# Altium schematic sheet EvoProject 1.0 - Fonte e uC.SchDoc
size A3
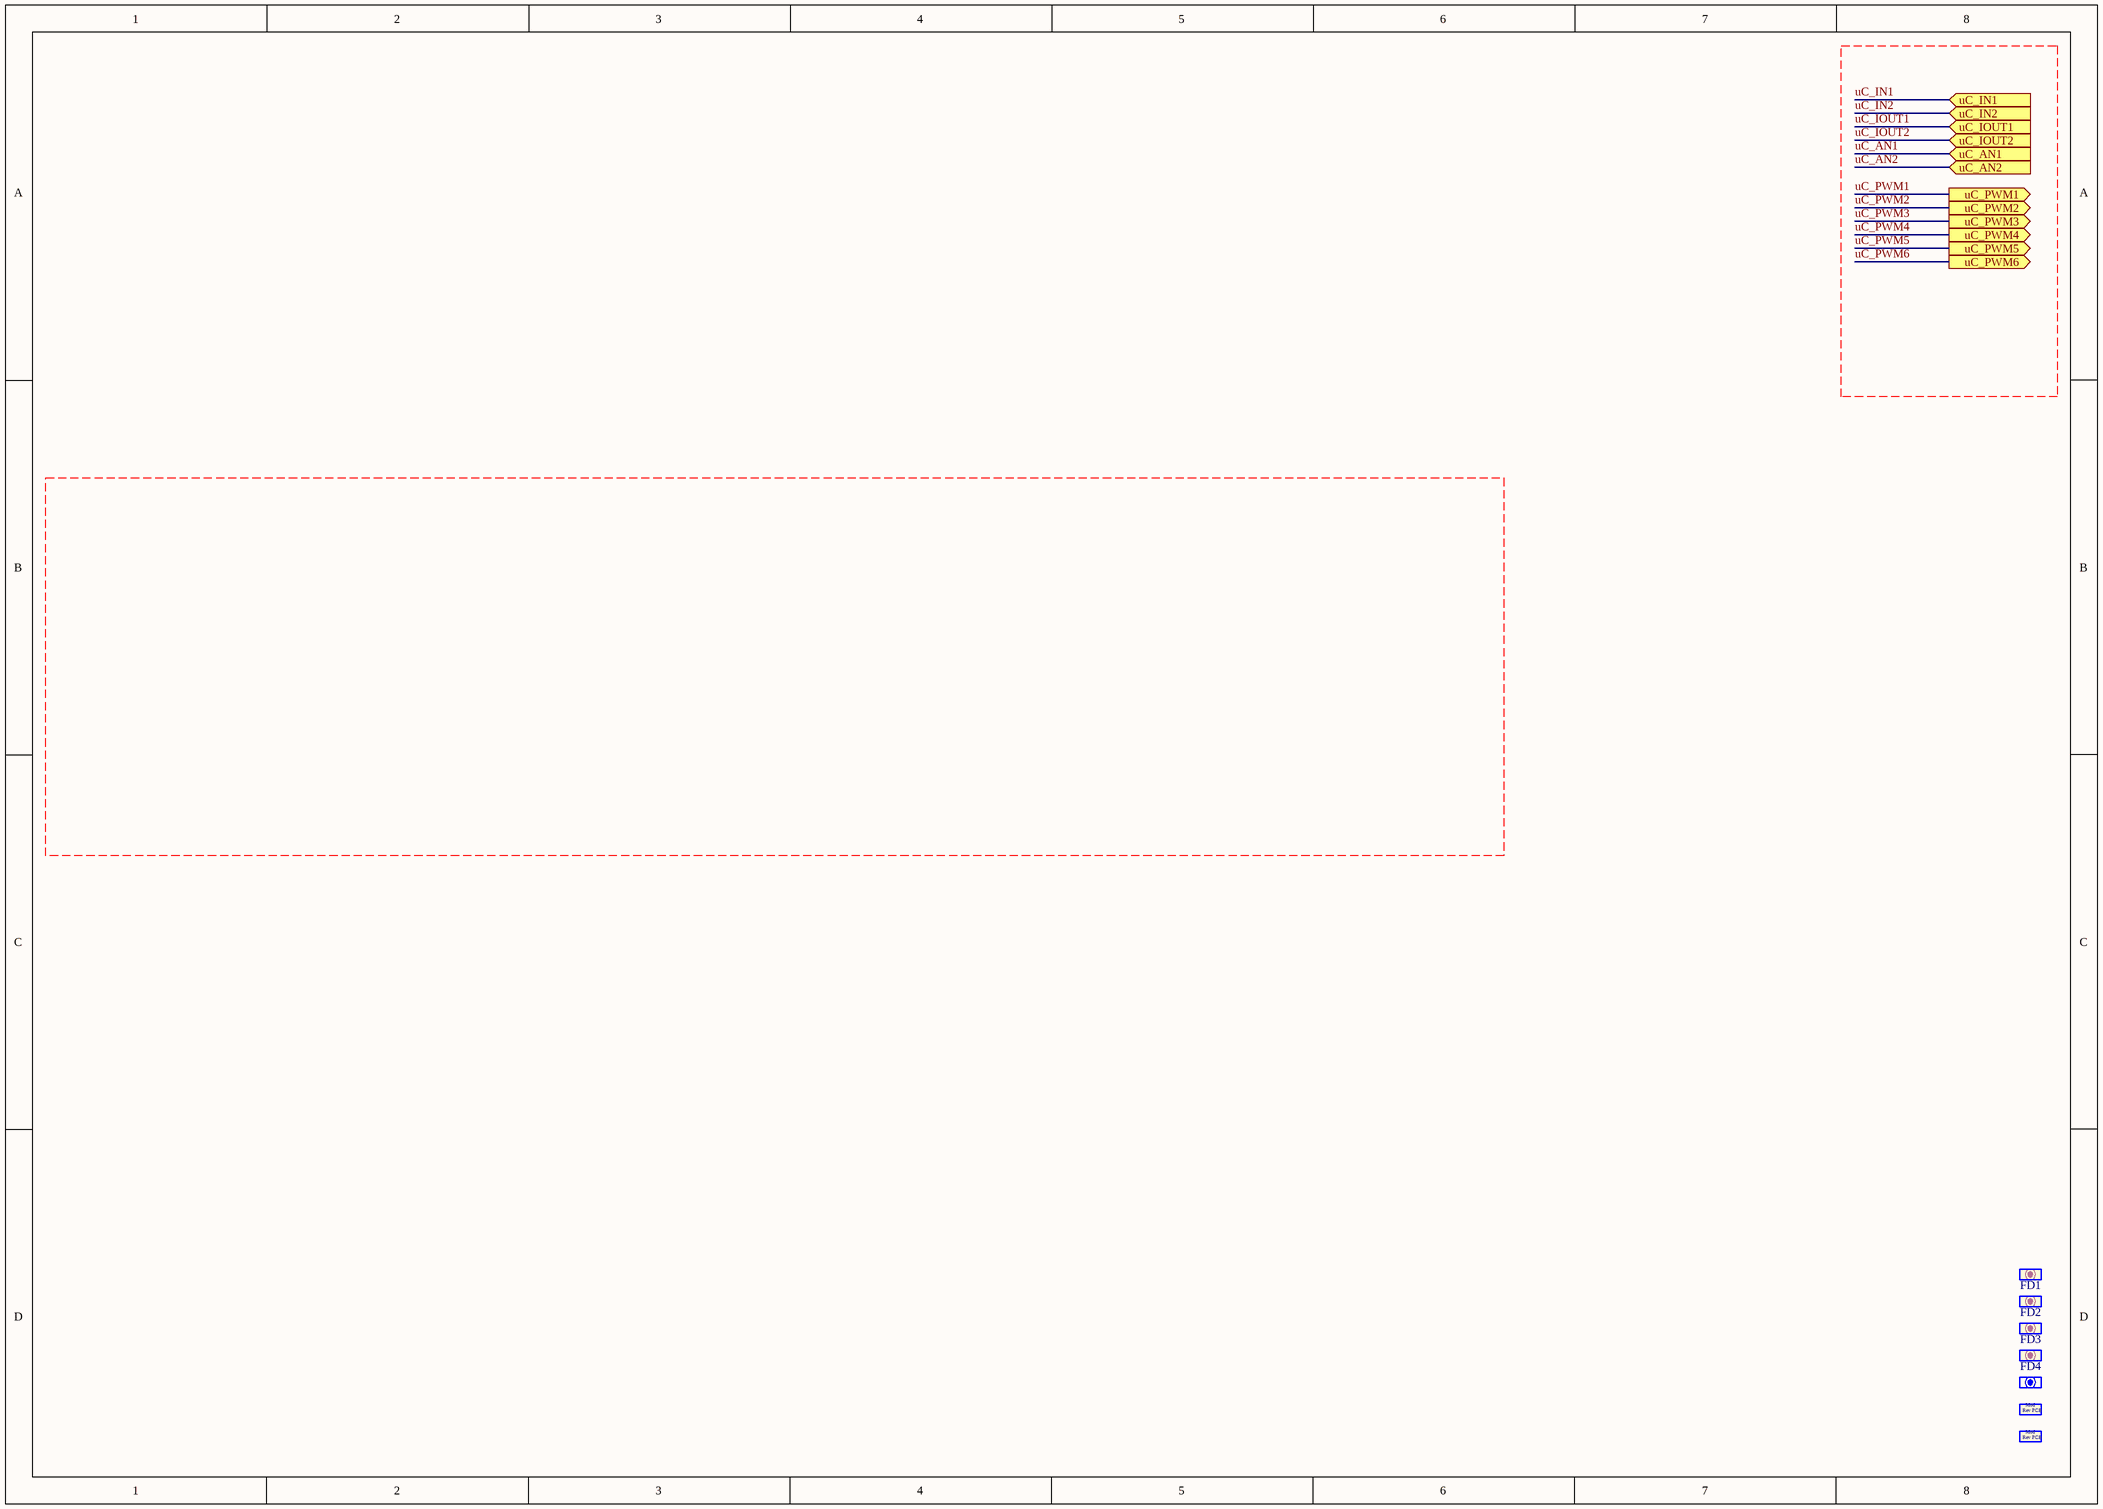
[diagram p0: EvoProject 1.0 - Fonte e uC.SchDoc]

## Parts
BM1  MEC BMK PCB  [MEC BMK R0.5K1 MR]  (value not drawn)  (no BOM)
FD1  MEC FD PickAndPlace  [MEC SMD FD R0.5K1.5 MR]  (value not drawn)
FD2  MEC FD PickAndPlace  [MEC SMD FD R0.5K1.5 MR]  (value not drawn)
FD3  MEC FD PickAndPlace  [MEC SMD FD R0.5K1.5 MR]  (value not drawn)
FD4  MEC FD PickAndPlace  [MEC SMD FD R0.5K1.5 MR]  (value not drawn)
ID1  (no value)  [MEC RV PCB MN]  (no BOM)
ID2  (no value)  [MEC RV PCB MN]  (no BOM)

## Ports
uC_AN1 (in), uC_AN2 (in), uC_IN1 (in), uC_IN2 (in), uC_IOUT1 (in), uC_IOUT2 (in), uC_PWM1 (out), uC_PWM2 (out), uC_PWM3 (out), uC_PWM4 (out), uC_PWM5 (out), uC_PWM6 (out)

## Nets
uC_AN1: port uC_AN1
uC_AN2: port uC_AN2
uC_IN1: port uC_IN1
uC_IN2: port uC_IN2
uC_IOUT1: port uC_IOUT1
uC_IOUT2: port uC_IOUT2
uC_PWM1: port uC_PWM1
uC_PWM2: port uC_PWM2
uC_PWM3: port uC_PWM3
uC_PWM4: port uC_PWM4
uC_PWM5: port uC_PWM5
uC_PWM6: port uC_PWM6

## Notes on the sheet
- (in symbol MEC RV PCB) Mod; Rev PCB

## Library data of the parts
BM1 = MEC BMK PCB: Bad Mark para Maquinas Pick and Place; Value: *
FD1-FD4 = MEC FD PickAndPlace: Fiducial High/Mid/Low Density para Maquinas Pick and Place; ERP: *
ID1 ID2 = MEC RV PCB: Nome da placa, codGAP e website INOVA para PCI; Value: *; ERP: *